# EAGLE design slow clock (EAGLE 8.5.2)

## Sheet 1 of 2
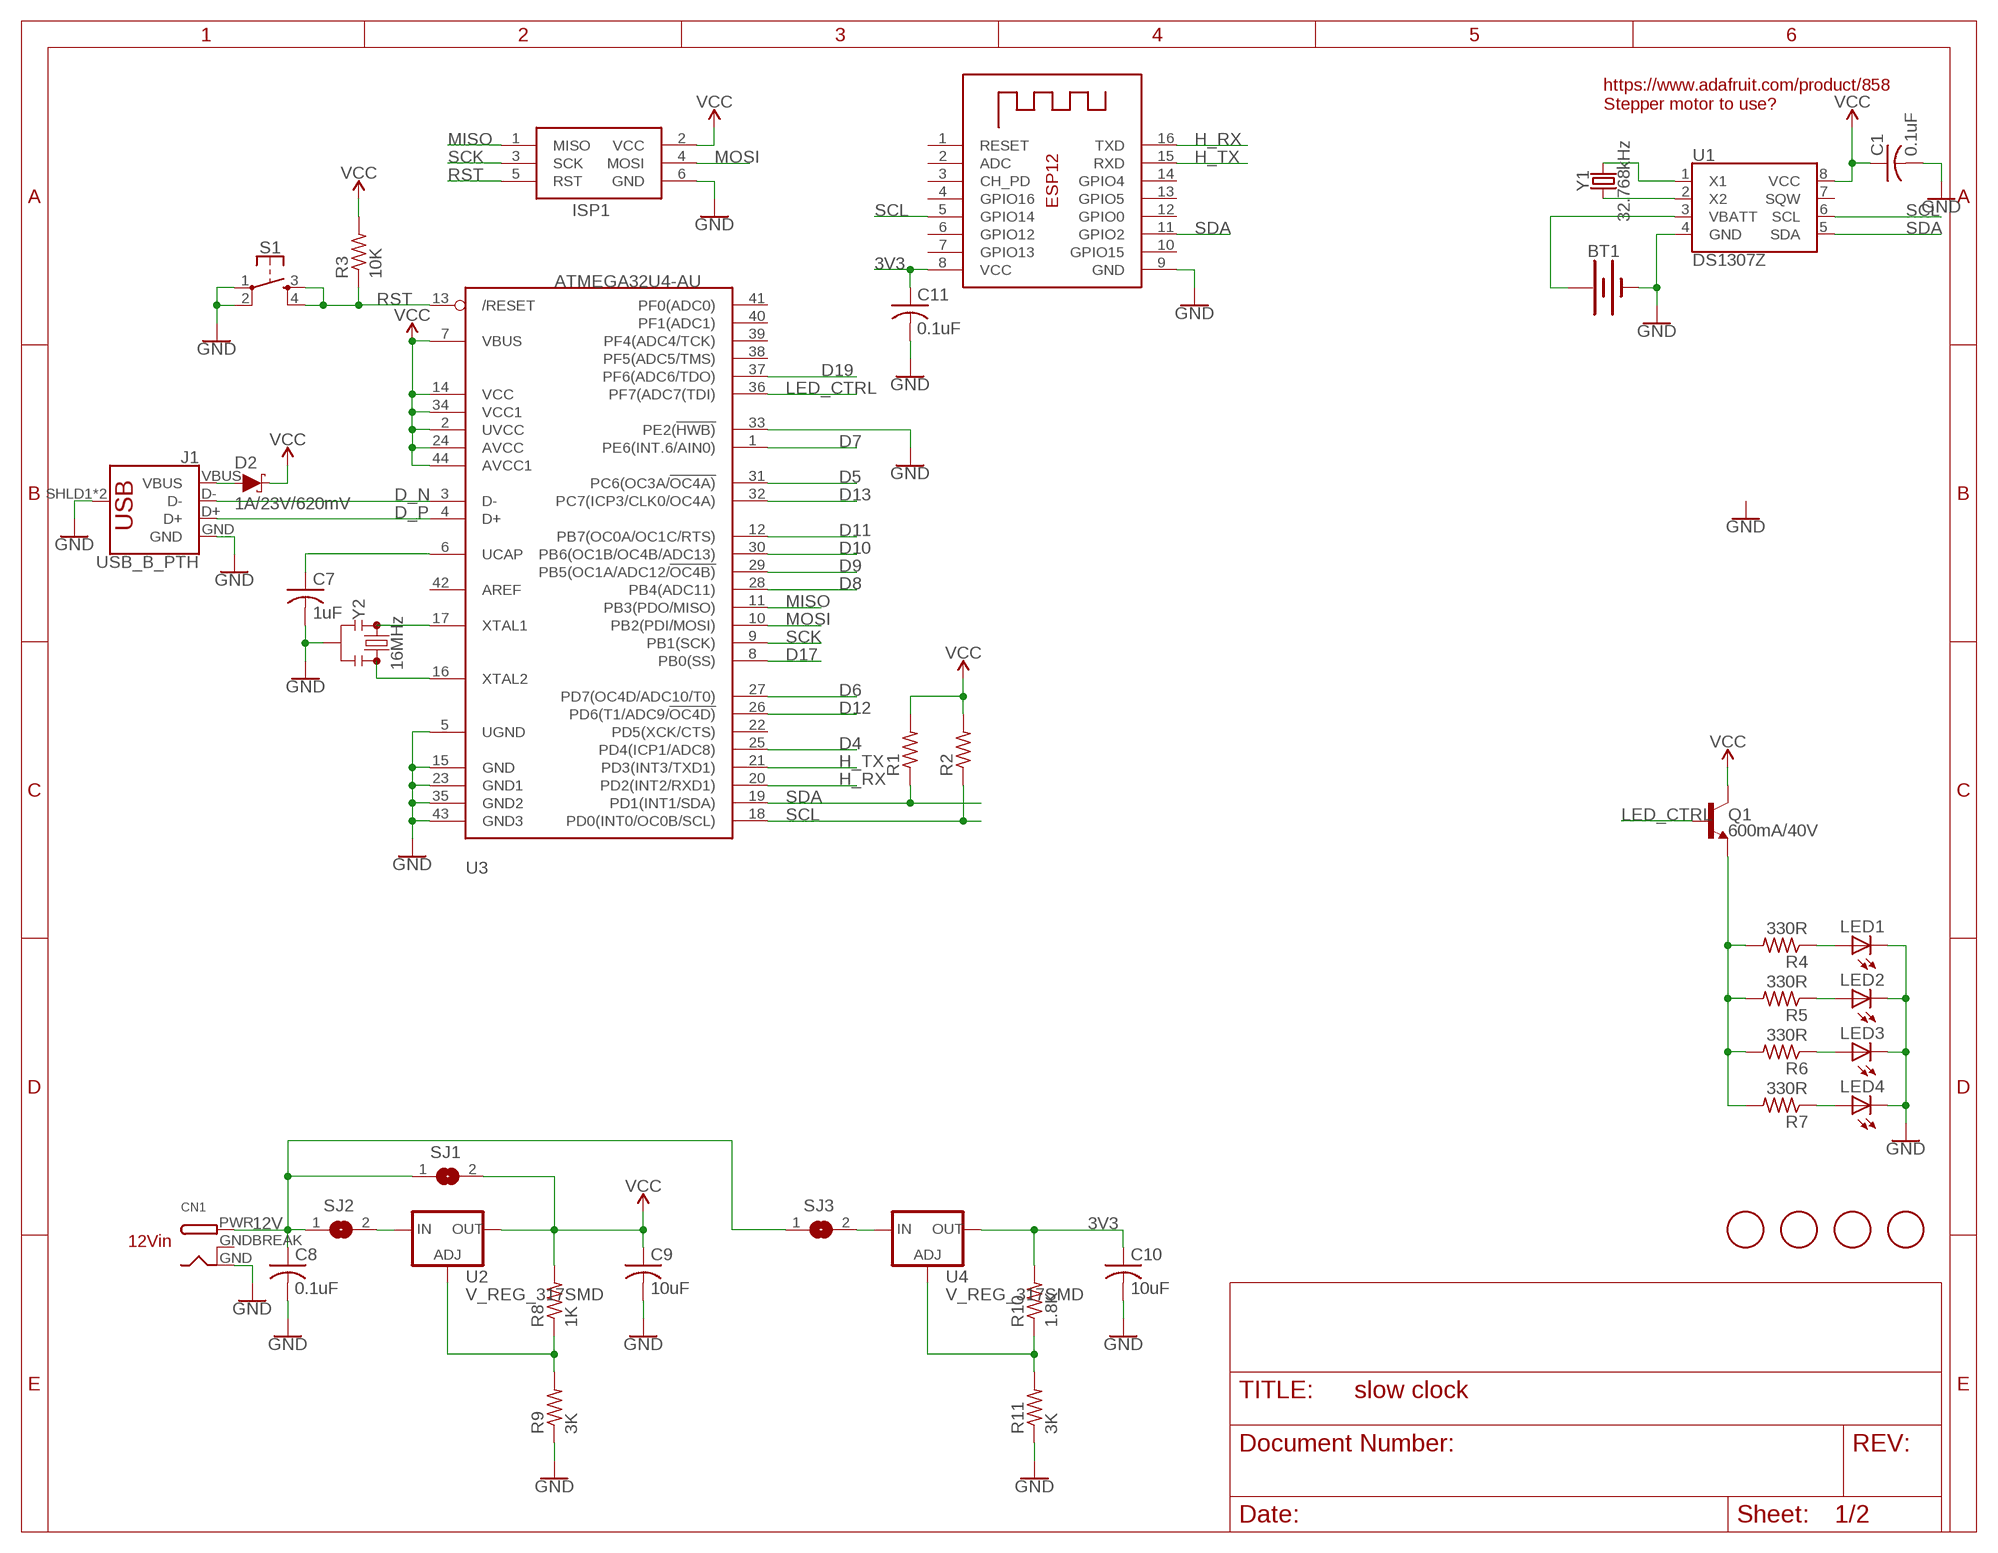
[diagram p0: schematic, sheet 1]

### Parts
BT1  BATTERY-12MM_SMD  [BATTCON_12MM]
C1  0.1uF  C-USC0805  [C0805]
C7  1uF  C-USC0805  [C0805]
C8  0.1uF  C-USC0805  [C0805]
C9  10uF  C-USC0805  [C0805]
C10  10uF  C-USC0805  [C0805]
C11  0.1uF  C-USC0805  [C0805]
CN1  DCBARRELPTH  [DCJACK_2MM_PTH]
D2  1A/23V/620mV  DIODE-SCHOTTKY-BAT20J  [SOD-323]
ISP1  AVRISP-6  [AVRISP]
J1  USB_B_PTH  [USB-B-PTH]
LED1  LEDCHIPLED_0805  [CHIPLED_0805]
LED2  LEDCHIPLED_0805  [CHIPLED_0805]
LED3  LEDCHIPLED_0805  [CHIPLED_0805]
LED4  LEDCHIPLED_0805  [CHIPLED_0805]
Q1  600mA/40V  TRANS_NPN-MMBT2222AL  [SOT23-3]
R1  R-US_R0805  [R0805]
R2  R-US_R0805  [R0805]
R3  10K  R-US_R0805  [R0805]
R4  330R  R-US_R0805  [R0805]
R5  330R  R-US_R0805  [R0805]
R6  330R  R-US_R0805  [R0805]
R7  330R  R-US_R0805  [R0805]
R8  1K  R-US_R0805  [R0805]
R9  3K  R-US_R0805  [R0805]
R10  1.8K  R-US_R0805  [R0805]
R11  3K  R-US_R0805  [R0805]
S1  MOMENTARY-SWITCH-SPST-2-SMD-5.2MM  [TACTILE_SWITCH_SMD_5.2MM]
SJ1  SJ  [SJ]
SJ2  SJ  [SJ]
SJ3  SJ  [SJ]
U1  DS1307Z  [SO08-0.15]
U2  V_REG_317SMD  [SOT223]
U3  ATMEGA32U4-AU  [TQFP44]
U4  V_REG_317SMD  [SOT223]
U$2  FIDUCIAL  [FIDUCIAL_1MM]
U$3  FIDUCIAL  [FIDUCIAL_1MM]
U$4  FIDUCIAL  [FIDUCIAL_1MM]
U$5  FIDUCIAL  [FIDUCIAL_1MM]
X1  ESP-12  [ESP-12]
Y1  32.768kHz  CRYSTAL-32.768KHZPTH-2X6-KIT  [CRYSTAL-PTH-2X6-CYL-KIT]
Y2  16MHz  RESONATOR-16MHZSMD_3.2X1.3  [RESONATOR-SMD-3.2X1.3]

### Nets
3V3: C10.1 C11.1 R10.2 U4.2(OUT) X1.8(VCC)
12V: C8.1 CN1.PWR SJ1.1 SJ2.1 SJ3.1 ; also sheet 2
D4: U3.25(PD4(ICP1/ADC8))
D5: U3.31(PC6(OC3A/!OC4A))
D6: U3.27(PD7(OC4D/ADC10/T0))
D7: U3.1(PE6(INT.6/AIN0))
D8: U3.28(PB4(ADC11))
D9: U3.29(PB5(OC1A/ADC12/!OC4B))
D10: U3.30(PB6(OC1B/OC4B/ADC13)) ; also sheet 2
D11: U3.12(PB7(OC0A/OC1C/RTS)) ; also sheet 2
D12: U3.26(PD6(T1/ADC9/!OC4D)) ; also sheet 2
D13: U3.32(PC7(ICP3/CLK0/OC4A)) ; also sheet 2
D17: U3.8(PB0(SS))
D19: U3.37(PF6(ADC6/TDO))
D_N: J1.D- U3.3(D-)
D_P: J1.D+ U3.4(D+)
GND: BT1.GND(-) C1.2 C7.2 C8.2 C9.2 C10.2 C11.2 CN1.GND ISP1.6(GND) J1.GND J1.SHLD1(SHIELD) J1.SHLD2(SHIELD) LED1.C LED2.C LED3.C LED4.C R9.1 R11.1 S1.1 S1.2 U1.4(GND) U3.5(UGND) U3.15(GND) U3.23(GND1) U3.33(PE2(!HWB)) U3.35(GND2) U3.43(GND3) X1.9(GND) Y2.2 ; also sheet 2
H_RX: U3.20(PD2(INT2/RXD1)) X1.16(TXD)
H_TX: U3.21(PD3(INT3/TXD1)) X1.15(RXD)
LED_CTRL: Q1.1(B) U3.36(PF7(ADC7(TDI))
MISO: ISP1.1(MISO) U3.11(PB3(PDO/MISO))
MOSI: ISP1.4(MOSI) U3.10(PB2(PDI/MOSI))
N$1: U1.2(X2) Y1.1
N$2: U1.1(X1) Y1.2
N$3: BT1.PWR@1(+) U1.3(VBATT)
N$4: U3.16(XTAL2) Y2.3
N$5: Q1.2(E) R4.2 R5.2 R6.2 R7.2
N$6: U3.17(XTAL1) Y2.1
N$7: D2.A J1.VBUS
N$8: C7.1 U3.6(UCAP)
N$9: LED1.A R4.1
N$10: LED2.A R5.1
N$11: LED3.A R6.1
N$12: LED4.A R7.1
N$13: SJ2.2 U2.3(IN)
N$26: R10.1 R11.2 U4.1(ADJ)
N$27: R8.1 R9.2 U2.1(ADJ)
N$28: SJ3.2 U4.3(IN)
RST: ISP1.5(RST) R3.1 S1.3 S1.4 U3.13(/RESET)
SCK: ISP1.3(SCK) U3.9(PB1(SCK))
SCL: R2.1 U1.6(SCL) U3.18(PD0(INT0/OC0B/SCL)) X1.5(GPIO14)
SDA: R1.1 U1.5(SDA) U3.19(PD1(INT1/SDA)) X1.11(GPIO2)
VCC: C1.1 C9.1 D2.C ISP1.2(VCC) Q1.3(C) R1.2 R2.2 R3.2 R8.2 SJ1.2 U1.8(VCC) U2.2(OUT) U3.2(UVCC) U3.7(VBUS) U3.14(VCC) U3.24(AVCC) U3.34(VCC1) U3.44(AVCC1) ; also sheet 2
Unconnected: U1.7(SQW) U3.22(PD5(XCK/CTS)) U3.38(PF5(ADC5/TMS)) U3.39(PF4(ADC4/TCK)) U3.40(PF1(ADC1)) U3.41(PF0(ADC0)) U3.42(AREF) X1.1(RESET) X1.2(ADC) X1.3(CH_PD) X1.4(GPIO16) X1.6(GPIO12) X1.7(GPIO13) X1.10(GPIO15) X1.12(GPIO0) X1.13(GPIO5) X1.14(GPIO4)

### Notes on the sheet
- https://www.adafruit.com/product/858 
  Stepper motor to use?
- 12Vin

## Sheet 2 of 2
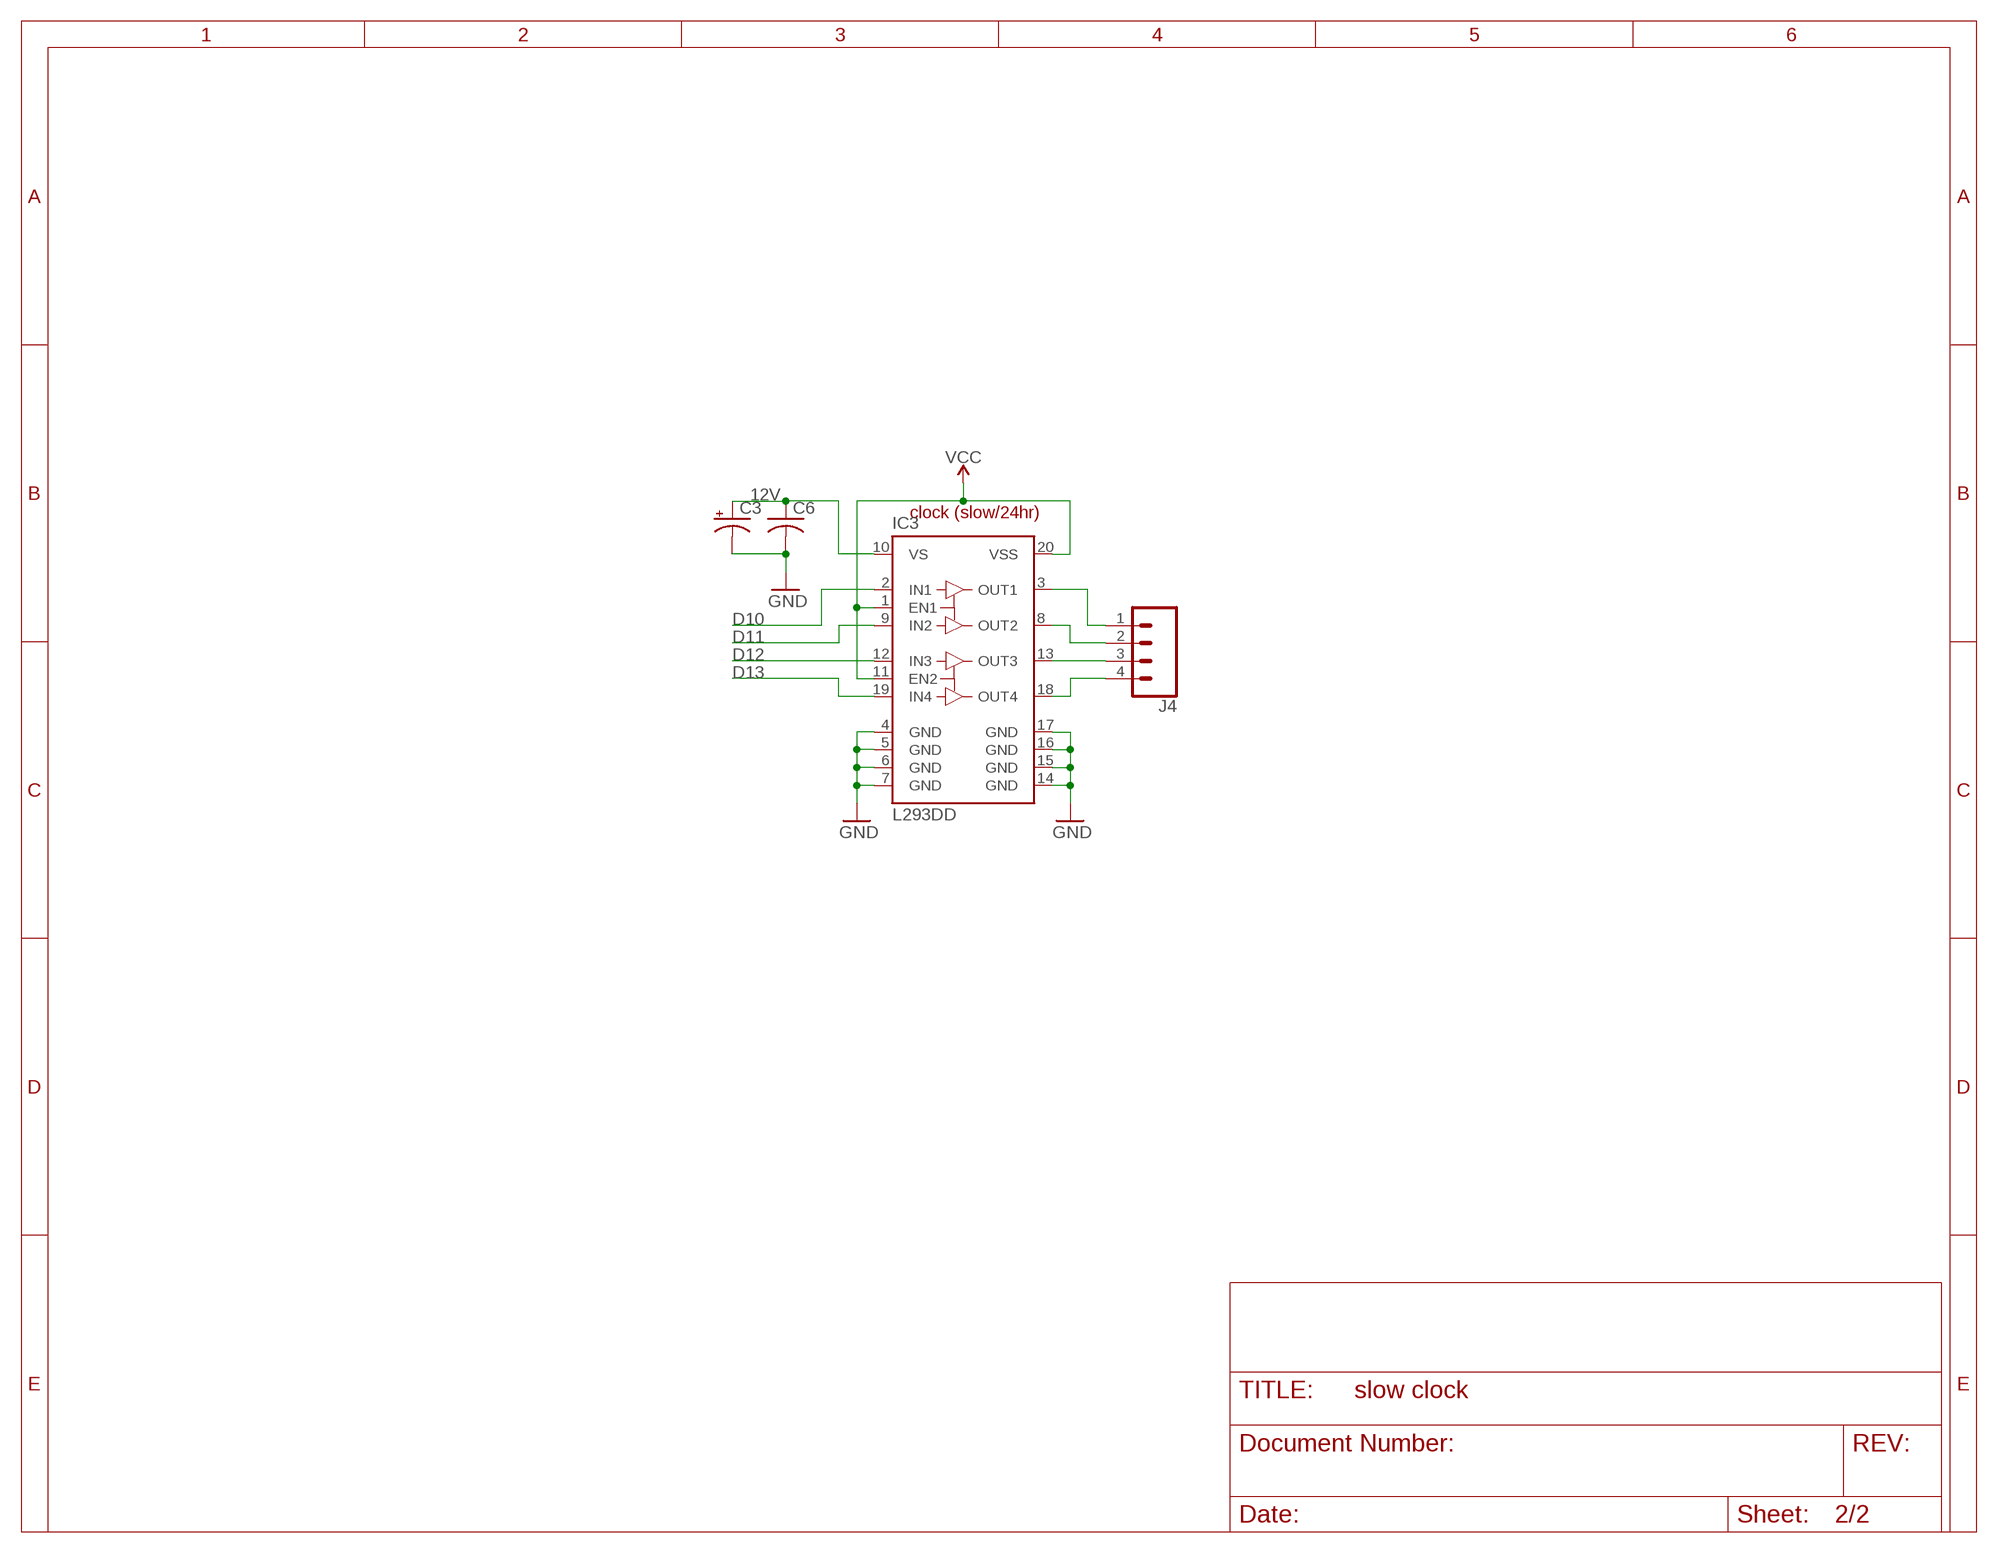
[diagram p1: schematic, sheet 2]

### Parts
C3  CPOL-USD  [PANASONIC_D]
C6  C-USC0805  [C0805]
IC3  L293DD  [SO20]
J4  CONN_04LOCK  [1X04_LOCK]

### Nets
12V: C3.+ C6.1 IC3.10(VS) ; also sheet 1
D10: IC3.2(IN1) ; also sheet 1
D11: IC3.9(IN2) ; also sheet 1
D12: IC3.12(IN3) ; also sheet 1
D13: IC3.19(IN4) ; also sheet 1
GND: C3.- C6.2 IC3.4(GND) IC3.5(GND) IC3.6(GND) IC3.7(GND) IC3.14(GND) IC3.15(GND) IC3.16(GND) IC3.17(GND) ; also sheet 1
N$14: IC3.3(OUT1) J4.1
N$15: IC3.8(OUT2) J4.2
N$16: IC3.13(OUT3) J4.3
N$17: IC3.18(OUT4) J4.4
VCC: IC3.1(EN1) IC3.11(EN2) IC3.20(VSS) ; also sheet 1

### Notes on the sheet
- clock (slow/24hr)

## Power pins joined to a net without a drawn wire
GNDBREAK: CN1.GNDBREAK

## Library data of the parts
BT1 = SparkFun-Batteries:BATTERY: Battery - Single Cell A variety of battery chemistries, sizes, and footprints. Device List: 20MM_PTH - Coin Cell Battery Holder - 20mm (PTH) <https://www.sparkfun.com/products/783> 6.8MM_PTH - Coin Cell Battery Holder - 6.8MM(SMD) <https://www.digikey.com/product-detail/en/seiko-instruments/MS621FE-FL11E/728-1057-ND/1889208?WT.srch=1&gclid=CNOQ5a6LzdQCFZS2wAodXCkE0g> 12MM_SMD - Coin Cell Battery Holder - 12mm (SMD) <https://www.sparkfun.com/products/10592> 12MM_PTH - Coin Cell Battery Holder - 12mm (PTH) <https://www.sparkfun.com/products/7948> 20MM_SMD - 20mm Coin Cell Battery Holder (SMD) (2 legs) Used on the Big Time Watch Kit <https://www.sparkfun.com/products/11734> 20MM_SMD_4LEGS - Coin Cell Battery Holder - 20mm (SMD) <https://www.sparkfun.com/products/11892> 20MM_SMD_4LEGS_OVERPASTE - Coin Cell Battery Holder - 20mm (SMD) <https://www.sparkfun.com/products/11892> (Over-paste on the legs) 24.5MM_PTH - Coin Cell Battery Holder - 24.5mm (PTH) <https://www.sparkfun.com/products/8863> 9V - 9V Battery Holder - PC Mount Used on the SparkFun SparkPunk Sound Kit <https://www.sparkfun.com/products/11177> and SparkFun SparkPunk Sequencer Kit <https://www.sparkfun.com/products/12707> 18650 - Battery Holder - 18650 (PTH) <https://www.sparkfun.com/products/13113> AA - Battery Holder - 1xAA (PTH) <https://www.sparkfun.com/products/7949> AAA - Battery Holder - 1xAAA (PTH) <https://www.sparkfun.com/products/12718> AA_KIT - Battery Holder - 1xAA (PTH) <https://www.sparkfun.com/products/7949> Special kit package - pads only have exposed copper on one side of the board. AAA_KIT - Battery Holder - 1xAAA (PTH) <https://www.sparkfun.com/products/12718> Special kit package - pads only have exposed copper on one side of the board.; PROD_ID: BATT-08044; SF_SKU: PRT-10592
C1 C6-C11 = resistor:C-US: CAPACITOR, American symbol
C3 = resistor:CPOL-US: POLARIZED CAPACITOR, American symbol
CN1 = adafruit:DCBARREL: 2.0mm DC Barrel Jack DCJACK_2MM_PTH - Through Hole Jack (4UConnector: 05537)
D2 = SparkFun-DiscreteSemi:DIODE-SCHOTTKY: Schottky diode A Schottky diode is a semiconductor diode which has a low forward voltage drop and a very fast switching action.; PROD_ID: DIO-11623
IC3 = st-microelectronics:L293DD: PUSH-PULL FOUR CHANNEL DRIVER WITH DIODES Source: http://www.st.com/stonline/books/pdf/docs/1330.pdf; OC_FARNELL: unknown
ISP1 = adafruit:AVRISP: AVR ISP HEADER Standard 6 pin header for AVR programming
J1 = SparkFun-Connectors:USB_B: USB Type B Connector SparkFun Products: SparkFun Stepoko <https://www.sparkfun.com/products/13899> PTH; PROD_ID: CONN-08278; SF_ID: PRT-00139
J4 = SparkFun-Connectors:CONN_04: Multi connection point. Often used as Generic Header-pin footprint for 0.1 inch spaced/style header connections On any of the 0.1 inch spaced packages, you can populate with these: Break Away Headers - Straight <https://www.sparkfun.com/products/116> (PRT-00116) Break Away Male Headers - Right Angle <https://www.sparkfun.com/products/553> (PRT-00553) Female Headers <https://www.sparkfun.com/products/115> (PRT-00115) Break Away Headers - Machine Pin <https://www.sparkfun.com/products/117> (PRT-00117) Break Away Female Headers - Swiss Machine Pin <https://www.sparkfun.com/products/743> (PRT-00743) For SCREWTERMINALS and SPRING TERMINALS visit here: Screw Terimnals on SparkFun.com <https://www.sparkfun.com/search/results?term=Screw+Terminals> (5mm/3.5mm/2.54mm spacing) This device is also useful as a general connection point to wire up your design to another part of your project. Our various solder wires solder well into these plated through hole pads. Hook-Up Wire - Assortment (Stranded, 22 AWG) <https://www.sparkfun.com/products/11375> (PRT-11375) Hook-Up Wire - Assortment (Solid Core, 22 AWG) <https://www.sparkfun.com/products/11367> (PRT-11367) View the entire wire category on our website here <https://www.sparkfun.com/categories/141> Special notes: Molex polarized connector foot print use with SKU : PRT-08231 with associated crimp pins and housings. 1MM SMD Version SKU: PRT-10208; PROD_ID: CONN-09696
LED1-LED4 = adafruit:LED: LED OSRAM: - CHIPLED LG R971, LG N971, LY N971, LG Q971, LY Q971, LO R971, LY R971 LH N974, LH R974 LS Q976, LO Q976, LY Q976 LO Q996 - Hyper CHIPLED LW Q18S LB Q993, LB Q99A, LB R99A - SideLED LS A670, LO A670, LY A670, LG A670, LP A670 LB A673, LV A673, LT A673, LW A673 LH A674 LY A675 LS A676, LA A676, LO A676, LY A676, LW A676 LS A679, LY A679, LG A679 - Hyper Micro SIDELED® LS Y876, LA Y876, LO Y876, LY Y876 LT Y87S - SmartLED LW L88C, LW L88S LB L89C, LB L89S, LG L890 LS L89K, LO L89K, LY L89K LS L896, LA L896, LO L896, LY L896 - TOPLED LS T670, LO T670, LY T670, LG T670, LP T670 LSG T670, LSP T670, LSY T670, LOP T670, LYG T670 LG T671, LOG T671, LSG T671 LB T673, LV T673, LT T673, LW T673 LH T674 LS T676, LA T676, LO T676, LY T676, LB T676, LH T676, LSB T676, LW T676 LB T67C, LV T67C, LT T67C, LS T67K, LO T67K, LY T67K, LW E67C LS E67B, LA E67B, LO E67B, LY E67B, LB E67C, LV E67C, LT E67C LW T67C LS T679, LY T679, LG T679 LS T770, LO T770, LY T770, LG T770, LP T770 LB T773, LV T773, LT T773, LW T773 LH T774 LS E675, LA E675, LY E675, LS T675 LS T776, LA T776, LO T776, LY T776, LB T776 LHGB T686 LT T68C, LB T68C - Hyper Mini TOPLED® LB M676 - Mini TOPLED Santana® LG M470 LS M47K, LO M47K, LY M47K Source: http://www.osram.convergy.de/
Q1 = SparkFun-DiscreteSemi:TRANS_NPN: NPN transistor Current controlled devices typically used to amplify current or used as a switch. BC547 - COM-08928 <http://www.sparkfun.com/products/8928> (TO-92 45V 100mA) (1.Collector 2.Base 3.Emitter) 2N3904 - COM-00521 <http://www.sparkfun.com/products/521> (TO-92 40V 200mA) (1.Emitter 2.Base 3.Collector) P2N2222A - COM-12852 <http://www.sparkfun.com/products/12852> (TO-92 40V 600mA) (1.Collector 2.Base 3.Emitter); PROD_ID: TRANS-08049
R1-R11 = resistor:R-US_: RESISTOR, American symbol
S1 = SparkFun-Switches:MOMENTARY-SWITCH-SPST-2: Momentary Switch (Pushbutton) - SPST - Two Circuits Normally-open (NO) SPST momentary switches (buttons, pushbuttons). Schematic symbol includes two switch circuits. Variants SMD-4.6MMX2.8MM - 4.60mm x 2.80mm Tactile Momentary Button Switch - Used on SparkFun SAMD21 Mini Breakout <https://www.sparkfun.com/products/13664> SMD-5.2MM - Mini Pushbutton Switch - SMD <https://www.sparkfun.com/products/8720> - Used on Arduino Pro Mini <https://www.sparkfun.com/products/11114>; PROD_ID: SWCH-08247; SF_SKU: COM-08720
SJ1-SJ3 = jumper:SJ: SMD solder JUMPER
U1 = SparkFun-Clocks:DS1307: Maxim DS1307 - I2C Real-time clock (RTC) The DS1307 serial real-time clock (RTC) is a low-power, full binary-coded decimal (BCD) clock/calendar plus 56 bytes of NV SRAM. Address and data are transferred serially through an I2C, bidirectional bus. The clock/calendar provides seconds, minutes, hours, day, date, month, and year information. SparkFun Products: Real Time Clock Module <https://www.sparkfun.com/products/12708> (BOB-12708) Datasheet <https://cdn.sparkfun.com/datasheets/BreakoutBoards/DS1307.pdf>; PROD_ID: IC-08138
U2 U4 = SparkFun-IC-Power:V_REG_317: Voltage Regulator Standard LM317 adjustable voltage regulator. AOI (Adjust Output Input). Google 'LM317 Calculator' for easy to use app to get the two resistor values needed. 240/720 for 5V output. 240/390 for 3.3V output. Spark Fun Electronics SKU : COM-00527
U3 = adafruit:ATMEGA32U4: http://www.ladyada.net/library/eagle
U$2-U$5 = adafruit:FIDUCIAL: For use by pick and place machines to calibrate the vision/machine, 1mm By microbuilder.eu
X1 = adafruit:ESP-12
Y1 = SparkFun-Clocks:CRYSTAL-32.768KHZ: 32.768kHz Crystal Frequency: 32.768kHz Frequency Stability: ±20ppm Load Capacitance: 12.5pF (PTH-2X6 & SMD-3.2X1.5), 6pF (SMD-2X6) SparkFun Products: SparkFun BigTime Watch Kit <https://www.sparkfun.com/products/11734> SparkFun nRF52832 Breakout <https://www.sparkfun.com/products/13990> SparkFun Real Time Clock Module <https://www.sparkfun.com/products/12708>; PROD_ID: XTAL-10112
Y2 = SparkFun-Clocks:RESONATOR-16MHZ: 16MHz Resonator Digikey Example <http://www.digikey.com/product-detail/en/murata-electronics-north-america/CSTCE16M0V53-R0/490-1198-1-ND/584635> Frequency: 16MHz Frequency Stability: ±0.3% Frequency Tolerance: ±0.5% Capacitance: 15pF SparkFun Products SparkFun OpenLog <https://www.sparkfun.com/products/13712> SparkFun MicroView - OLED Arduino Module <https://www.sparkfun.com/products/12923>; PROD_ID: XTAL-08900

## Board
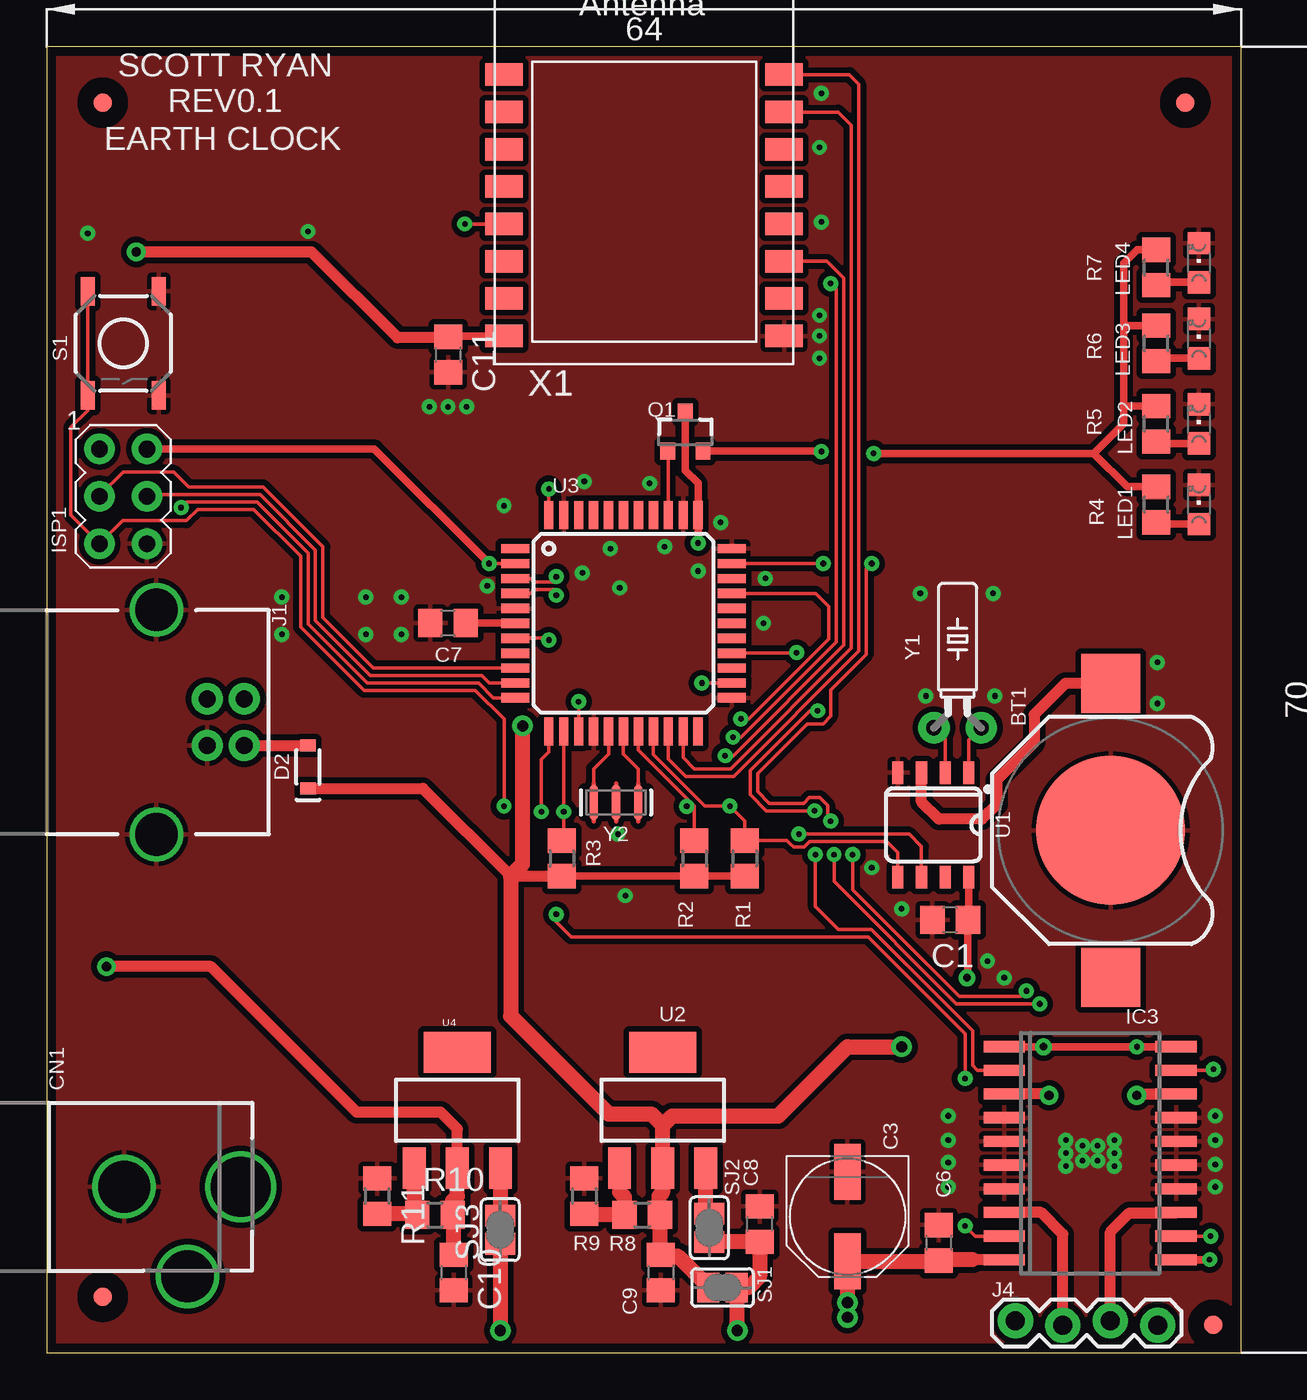
[diagram p2: board, top side]
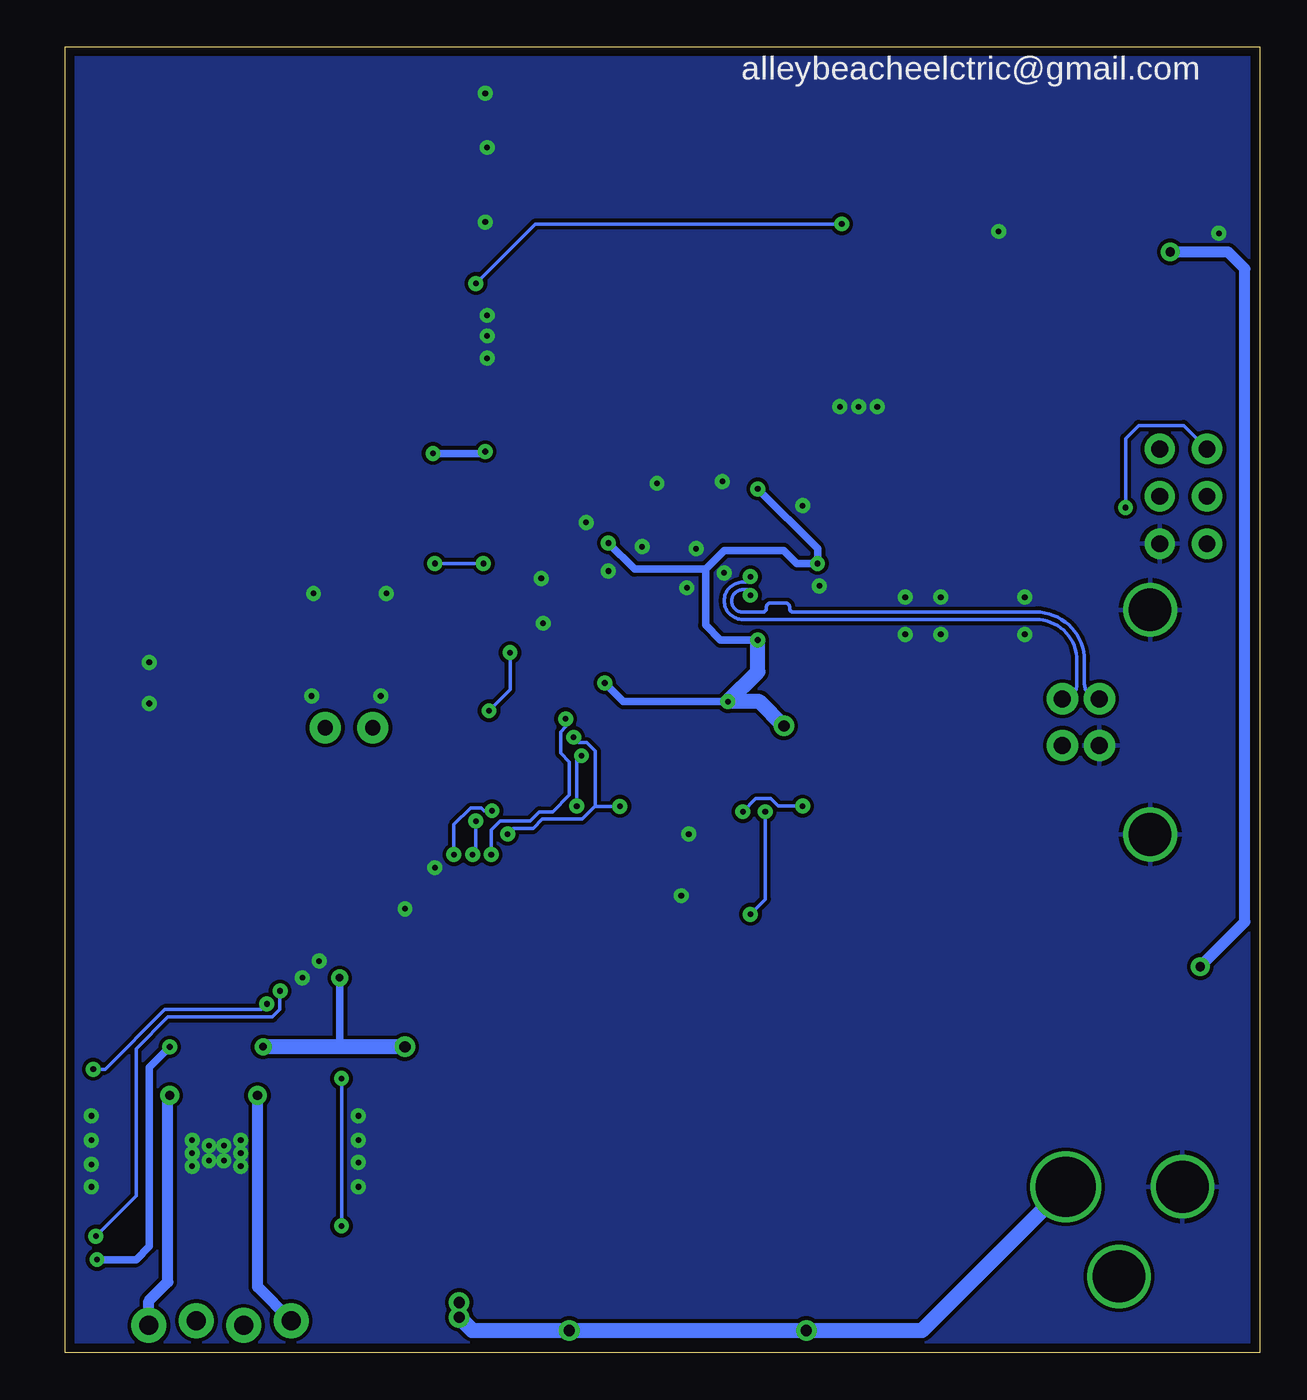
[diagram p3: board, bottom side, seen from below]

Size 64 x 70 mm. Coordinates in mm from the lower left corner, seen from the top.
Outline: 0,0 64,0 64,70 0,70 0,0
Copper layers (1*16): Top 0.035mm / dielectric 1.5mm / Bottom 0.035mm
Design rules "Class_5_0,20mm *": minimum track width 0.2mm, minimum drill 0.3mm, track to track 0.2mm, track to pad 0.2mm, pad to pad 0.2mm, via to via 0.2mm, smd to smd 0.2mm, copper to edge 0.5mm, drill to drill 0.2mm, minimum pad ring 0.3mm, minimum via ring 0.25mm, stop-mask expansion 0.1mm, vias tented up to drill 0.6mm, thermal gap 0.25mm

### Footprints (pad centres in the part's own frame; a part is rotated, then mirrored left to right if it is on the bottom)
BATTCON_12MM = smd 8 x 8: GND 0,0 | smd 3.175 x 3.175: PWR@1 -7.874,0; PWR@2 7.874,0
C0805 = smd 1.3 x 1.5: 1 -0.95,0; 2 0.95,0
PANASONIC_D = smd 3 x 1.4: + 2.4,0; - -2.4,0
DCJACK_2MM_PTH = drill 2.8: GND 0,7.35; GNDBREAK 4.8,10.75 | drill 3.2: PWR 0,13.6
SOD-323 = smd 0.63 x 0.83: A 1.15,0; C -1.15,0
SO20 = smd 0.6 x 2.2: 1 -5.715,-4.6; 2 -4.445,-4.6; 3 -3.175,-4.6; 4 -1.905,-4.6; 5 -0.635,-4.6; 6 0.635,-4.6; 7 1.905,-4.6; 8 3.175,-4.6; 9 4.445,-4.6; 10 5.715,-4.6; 11 5.715,4.6; 12 4.445,4.6; 13 3.175,4.6; 14 1.905,4.6; 15 0.635,4.6; 16 -0.635,4.6; 17 -1.905,4.6; 18 -3.175,4.6; 19 -4.445,4.6; 20 -5.715,4.6
AVRISP = drill 0.9 pad 1.626: 1 -1.27,2.54; 2 1.27,2.54; 3 -1.27,0; 4 1.27,0; 5 -1.27,-2.54; 6 1.27,-2.54
USB-B-PTH = drill 0.914 pad 1.676: D+ 4,1.25; D- 5.981,1.25; GND 4,-1.25; VBUS 5.981,-1.25 | drill 2.286: SHLD1 1.282,-6.02; SHLD2 1.282,6.02
1X04_LOCK = drill 1.016 pad 1.88: 1 0,0.127; 2 2.54,-0.127; 3 5.08,0.127; 4 7.62,-0.127
CHIPLED_0805 = smd 1.2 x 1.2: A 0,-1.05; C 0,1.05
SOT23-3 = smd 0.8 x 0.9: 1 -0.95,-1; 2 0.95,-1; 3 0,1.1
R0805 = smd 1.3 x 1.5: 1 -0.95,0; 2 0.95,0
TACTILE_SWITCH_SMD_5.2MM = smd 1.524 x 0.762: 1 -2.794,1.905; 2 2.794,1.905; 3 -2.794,-1.905; 4 2.794,-1.905
SJ = smd 1.168 x 1.6: 1 -0.762,0; 2 0.762,0
SO08-0.15 = smd 0.6 x 1.2: 1 -1.905,-2.8; 2 -0.635,-2.8; 3 0.635,-2.8; 4 1.905,-2.8; 5 1.905,2.8; 6 0.635,2.8; 7 -0.635,2.8; 8 -1.905,2.8
SOT223 = smd 1.219 x 2.235: 1 -2.311,-3.099; 2 0,-3.099; 3 2.311,-3.099 | smd 3.6 x 2.2: 4 0,3.099
TQFP44 = smd 1.5 x 0.5: 1 -5.8,4; 2 -5.8,3.2; 3 -5.8,2.4; 4 -5.8,1.6; 5 -5.8,0.8; 6 -5.8,0; 7 -5.8,-0.8; 8 -5.8,-1.6; 9 -5.8,-2.4; 10 -5.8,-3.2; 11 -5.8,-4; 23 5.8,-4; 24 5.8,-3.2; 25 5.8,-2.4; 26 5.8,-1.6; 27 5.8,-0.8; 28 5.8,0; 29 5.8,0.8; 30 5.8,1.6; 31 5.8,2.4; 32 5.8,3.2; 33 5.8,4 | smd 0.5 x 1.5: 12 -4,-5.8; 13 -3.2,-5.8; 14 -2.4,-5.8; 15 -1.6,-5.8; 16 -0.8,-5.8; 17 0,-5.8; 18 0.8,-5.8; 19 1.6,-5.8; 20 2.4,-5.8; 21 3.2,-5.8; 22 4,-5.8; 34 4,5.8; 35 3.2,5.8; 36 2.4,5.8; 37 1.6,5.8; 38 0.8,5.8; 39 0,5.8; 40 -0.8,5.8; 41 -1.6,5.8; 42 -2.4,5.8; 43 -3.2,5.8; 44 -4,5.8
FIDUCIAL_1MM = smd 1 x 1: 1 0,0
ESP-12 = smd 2 x 1.2: 1 -7.5,4.5; 2 -7.5,2.5; 3 -7.5,0.5; 4 -7.5,-1.5; 5 -7.5,-3.5; 6 -7.5,-5.5; 7 -7.5,-7.5; 8 -7.5,-9.5; 9 7.5,-9.5; 10 7.5,-7.5; 11 7.5,-5.5; 12 7.5,-3.5; 13 7.5,-1.5; 14 7.5,0.5; 15 7.5,2.5; 16 7.5,4.5
CRYSTAL-PTH-2X6-CYL-KIT = drill 0.813 pad 1.676: 1 -1.27,0; 2 1.27,0
RESONATOR-SMD-3.2X1.3 = smd 0.45 x 1.905: 1 -1.2,0; 2 0,0; 3 1.2,0

### Placement (x,y rotation side)
BT1  57,28 270 top
C1  48.4,23.2 180 top
C3  42.9,7.3 270 top
C6  47.8,5.9 90 top
C7  21.5,39.1 180 top
C8  38.2,6.9 90 top
C9  32.9,4.3 270 top
C10  21.8,4.3 270 top
C11  21.5,53.5 270 top
CN1  -3.2,8.9 270 top
D2  14,31.4 90 top
IC3  55.9,10.7 270 top
ISP1  4.1,45.9 0 top
J1  4.6,33.8 0 top
J4  51.9,1.6 0 top
LED1  61.72,45.46 0 top
LED2  61.72,49.78 0 top
LED3  61.72,54.35 0 top
LED4  61.72,58.42 0 top
Q1  34.21,49.32 0 top
R1  37.4,26.5 270 top
R2  34.7,26.5 270 top
R3  27.6,26.5 270 top
R4  59.44,45.46 90 top
R5  59.44,49.78 90 top
R6  59.44,54.1 90 top
R7  59.44,58.16 90 top
R8  31.9,7.4 0 top
R9  28.8,8.4 270 top
R10  20.8,7.4 0 top
R11  17.7,8.4 270 top
S1  4.1,54.1 270 top
SJ1  36.2,3.5 180 top
SJ2  35.5,6.7 90 top
SJ3  24.3,6.6 90 top
U1  47.5,28.3 180 top
U2  33,13 0 top
U3  30.9,39.1 0 top
U4  22,13 0 top
U$2  61,67 0 top
U$3  3,67 0 top
U$4  62.5,1.5 0 top
U$5  3,3 0 top
X1  32,64 0 top
Y1  48.8,33.5 0 top
Y2  30.5,29.5 180 top

### Tracks (layer width: path | path; a pad name or v marks a point on that pad's centre or on a via)
3V3  (via drill 0.5)
  Top 0.4: X1.8 21.55,54.5 C11.1
  Top 0.6: U4.2 22,12 21.1,12.9 16.6,12.9 8.8,20.7 v3.2,20.7 | C11.1 21.45,54.4 18.8,54.4 14.2,59 v4.8,59
  Top 0.8: C10.1 21.8,7.35 R10.2 21.75,8.15 22,8.4 U4.2
  Bottom 0.6: v3.2,20.7 0.8,23.1 0.8,58.1 1.7,59 v4.8,59
12V  (via drill 0.6)
  Top 0.6: IC3.10 49.62,4.99 49.6,5
  Top 0.8: 49.6,5 47.85,5 C6.1 47.75,4.9 C3.+ v42.9,2.7 v42.9,1.9 | SJ3.1 v24.3,1.2 | SJ2.1 38.19,5.94 C8.1 38.2,4.1 37.6,3.5 SJ1.1 36.96,1.24 v37,1.2
  Bottom 0.8: v42.9,2.7 v42.9,1.9 42.2,1.2 v37,1.2 v24.3,1.2 18.1,1.2 12,7.3 CN1.PWR
D10  (via drill 0.3)
  Top 0.2: IC3.2 49.85,15.14 49.6,15.4 49.6,17.27 44.17,22.7 42.4,22.7 41.18,23.92 v41.18,26.7 | v37.19,33.98 37.62,33.98 41.9,38.26 41.9,40 41.2,40.7 U3.30
  Bottom 0.2: v41.18,26.7 41.18,28.02 40.7,28.5 39.1,28.5 38.6,29 37.89,29 37,29.89 37,31.67 37.47,32.13 37.47,33.28 37.19,33.56 | 37.19,33.56 | v37.19,33.98 37.19,33.6 37.19,33.56
D11  (via drill 0.3)
  Top 0.2: IC3.9 49.74,6.25 v49.2,6.8 | v27.3,23.5 27.3,23.1 28.1,22.3 44,22.3 49.2,17.1 v49.2,14.7 | v26.5,29 26.5,31.8 26.9,32.2 U3.12
  Bottom 0.2: v27.3,23.5 26.5,24.3 v26.5,29 | v49.2,6.8 v49.2,14.7
D12  (via drill 0.3)
  Top 0.2: IC3.12 v62.35,6.25 | v52.49,19.4 52.19,19.1 48.9,19.1 43.18,24.82 v43.18,26.7 | v40.17,37.53 40.15,37.5 U3.26 | v41.14,29.05 38.55,29.05 37.68,29.92 37.68,31.22 40.88,34.41 v41.3,34.41
  Bottom 0.2: v62.35,6.25 60.2,8.41 60.2,16.3 58.5,18 52.91,18 52.5,18.41 52.5,19.39 v52.49,19.4 | v41.14,29.05 41.56,29.05 41.71,29.2 42.29,29.2 43.18,28.31 v43.18,26.7 | v41.3,34.41 40.17,35.54 v40.17,37.53
D13  (via drill 0.3)
  Top 0.2: v62.5,15.2 62.45,15.14 IC3.19 | U3.32 v41.6,42.3 | v44.2,42.3 43.9,42 43.9,37.43 42,35.53 42,34.12 41.59,33.71 40.74,33.71 38.08,31.05 38.08,30.08 38.71,29.45 40.55,29.45 40.85,29.75 41.43,29.75 41.84,29.34 41.84,28.66 v42,28.5 | v42.18,26.7 42.18,25.25 48.73,18.7 v53.2,18.7
  Bottom 0.2: v62.5,15.2 61.87,15.2 58.67,18.4 53.5,18.4 v53.2,18.7 | v41.6,42.3 v44.2,42.3 | v42,28.5 42,26.88 v42.18,26.7
D_N  (via drill 0.3)
  Top 0.2: v27.3,41.6 27.3,41.3 26.1,41.3 25.9,41.5 U3.3
  Bottom 0.2: J1.D- arc-90 9.8,35.83 9.8,37.1 arc-90 12,39.3 27.7,39.3 arc90 28.7,40.3 arc90 27.7,41.3 27.3,41.3 v27.3,41.6
D_P  (via drill 0.3)
  Top 0.2: v27.3,40.6 27.3,40.9 26.1,40.9 25.9,40.7 U3.4
  Bottom 0.2: J1.D+ arc90 9.4,35.85 9.4,37.1 arc-90 12,39.7 25,39.7 arc90 25.2,39.9 25.2,39.98 arc-90 25.4,40.18 26.24,40.18 arc-90 26.44,39.98 26.44,39.9 arc90 26.64,39.7 27.7,39.7 arc90 28.3,40.3 arc90 27.7,40.9 27.3,40.9 v27.3,40.6
GND  (via drill 0.3)
  other vias: 28.7,41.8 56.3,11.1 55.5,11.1 55.5,10.3 56.3,10.3 57.2,10 57.2,10.7 57.2,11.4 54.6,10.7 54.6,11.4 54.6,10 23.6,41.1 30.6,27.8 31,24.5 48.3,12.7 48.3,11.4 48.3,10.2 48.3,8.9 62.6,8.9 62.6,10.1 62.6,11.4 62.6,12.7 45.8,23.8 44.2,26 51.3,20.1 50.4,21 59.5,34.8 59.5,37 50.8,35.2 50.7,40.7 46.8,40.7 47.1,35.2 34.9,41.9 36.1,44.5 38.5,41.5 38.4,39.1 33.1,43.2 32.3,46.6 28.8,46.7 30.2,43.1 30.7,41 24.5,45.4 19,38.5 19,40.5 17.1,38.5 17.1,40.5 12.6,40.5 12.6,38.5 2.2,60 14,60.1 41.4,54.5 41.4,55.6 41.4,53.3 21.5,50.7 22.5,50.7 20.5,50.7 41.5,60.6 41.4,64.6 41.5,67.5
  pour Top (isolate 0.305): 0,0 0,69.85 63.5,69.85 63.5,0
  pour Bottom: 63.5,0 64.01,69.85 0,69.85 0,0
H_RX
  Top 0.2: X1.16 43,68.5 43.5,68 43.5,37.6 36.8,30.9 34.23,30.9 33.3,31.83 U3.20
H_TX
  Top 0.2: X1.15 42.4,66.5 43.1,65.8 43.1,37.77 36.63,31.3 34.7,31.3 34.1,31.9 U3.21
LED_CTRL
  Top 0.2: U3.36 33.3,48.28 Q1.1
MISO  (via drill 0.3)
  Top 0.2: U3.11 23.93,35.1 23.13,35.9 17.17,35.9 14,39.07 14,42.87 11.27,45.6 9.3,45.6 7.5,45.6 v7.2,45.3
  Bottom 0.2: v7.2,45.3 7.2,49 6.5,49.7 4.09,49.7 ISP1.1
MOSI
  Top 0.2: U3.10 23.7,35.9 23.3,36.3 17.33,36.3 14.4,39.23 14.4,43.03 11.43,46 5.47,46 ISP1.4
N$1
  Top 0.2: Y1.1 48.13,32.9 U1.2
N$2
  Top 0.2: Y1.2 49.41,32.84 U1.1
N$3
  Top 0.6: BT1.PWR@1 54.57,35.87 52.9,34.2 52.9,32.7 50.9,30.7 50.9,29.4 50.1,28.6 47.8,28.6 46.87,29.54 U1.3
N$4
  Top 0.2: U3.16 30.1,32.1 29.3,31.3 Y2.3
N$5  (via drill 0.3)
  Top 0.4: Q1.2 41.48,48.32 v41.5,48.3 | v44.3,48.2 56.1,48.2 | R4.2 57.89,46.41 56.1,48.2 | 56.1,48.2 57.7,49.8 57.7,50.8 | 57.7,50.8 57.7,55 | 57.7,55 57.7,58.4 58.41,59.11 R7.2 | R6.2 57.75,55.05 57.7,55 | R5.2 57.77,50.73 57.7,50.8
  Bottom 0.4: v41.5,48.3 41.6,48.2 v44.3,48.2
N$6
  Top 0.2: U3.17 30.9,32.1 31.7,31.3 Y2.1
N$7
  Top 0.6: J1.VBUS D2.A
N$8
  Top 0.4: C7.1 U3.6
N$9
  Top 0.4: LED1.A 59.54,44.41 R4.1
N$10
  Top 0.4: LED2.A 59.54,48.73 R5.1
N$11
  Top 0.4: LED3.A 59.59,53.3 R6.1
N$12
  Top 0.4: LED4.A 59.59,57.37 R7.1
N$13
  Top 0.8: SJ2.2 35.31,7.65 U2.3
N$14  (via drill 0.5)
  Top 0.6: v53.7,13.8 53.62,13.88 IC3.3
  Bottom 0.6: J4.1 53.7,3.53 v53.7,13.8
N$15
  Top 0.6: J4.2 54.44,6.36 53.27,7.53 IC3.8
N$16
  Top 0.6: J4.3 56.98,6.48 58,7.5 60.48,7.5 IC3.13
N$17  (via drill 0.5)
  Top 0.6: v58.4,13.8 58.48,13.88 IC3.18
  Bottom 0.6: J4.4 59.52,2.78 58.5,3.8 58.5,13.7 v58.4,13.8
N$26
  Top 0.8: U4.1 19.69,7.56 R10.1 19.8,7.45 R11.2
N$27
  Top 0.8: R9.2 28.85,7.4 R8.1 30.95,8.35 30.69,8.61 U2.1
N$28
  Top 0.8: U4.3 SJ3.2
RST  (via drill 0.3)
  Top 0.2: R3.1 27.7,27.55 v27.7,29 U3.13 | S1.3 S1.4 2.19,50.49 1.3,49.6 1.3,44.89 ISP1.5 4.07,44.6 7.49,44.6 8.09,45.2 11.1,45.2 13.6,42.7 13.6,38.9 17,35.5 22.97,35.5 24.5,33.97 v24.5,29.3
  Bottom 0.2: v24.5,29.3 25.81,29.3 26.21,29.7 27,29.7 v27.7,29
SCK
  Top 0.2: U3.9 17.5,36.7 14.8,39.4 14.8,43.2 11.6,46.4 7.6,46.4 6.8,47.2 4.1,47.2 2.83,45.93 ISP1.3
SCL  (via drill 0.3)
  Top 0.2: U1.6 46.87,27.14 46.2,27.8 v40.3,27.8 | 34.65,27.4 R2.1 34.7,29.3 34.6,29.4 | U3.18 31.7,32.3 34.6,29.4 | X1.5 v22.4,60.5 | v42,57.31 42.3,57.01 42.3,38.1 37.19,32.99 v36.77,32.99 | v34.29,29.29 34.49,29.29 34.6,29.4
  Bottom 0.2: v22.4,60.5 38.81,60.5 v42,57.31 | v36.77,32.99 36.48,32.7 36.2,32.7 36.05,32.7 35.6,32.25 35.6,29.29 | v40.3,27.8 40,28.1 38.93,28.1 38.43,28.6 36.31,28.6 35.62,29.29 35.6,29.29 | 35.6,29.29 v34.29,29.29
SDA  (via drill 0.3)
  Top 0.2: U1.5 45.59,26.8 45,27.4 40.89,27.4 40.59,27.1 40.01,27.1 39.8,27.3 39.66,27.45 R1.1 37.4,28.5 v36.6,29.3 35.27,29.3 32.5,32.07 U3.19 | X1.11 41.8,58.5 42.7,57.6 42.7,37.93 36.77,32 v36.34,32
  Bottom 0.2: v36.34,32 36.6,31.74 v36.6,29.3
VCC  (via drill 0.3, 0.4, 0.6)
  Top 0.2: U3.14 v28.5,34.9 | U3.24 v35.1,35.9 | U3.2 v23.7,42.3 | U3.44 v26.9,46.3 | U3.7 26.8,38.3 v26.9,38.2
  Top 0.4: R1.2 R2.2 R3.2 | U1.8 49.41,23.25 C1.1 49.35,20.15 v49.3,20.1 | Q1.3 34.21,47.29 34.9,46.6 U3.34 v34.9,43.4 | v23.7,42.3 17.56,48.44 ISP1.2 | IC3.11 62.28,4.99 v62.3,5 | IC3.20 60.48,16.4 v58.4,16.4 v53.4,16.4 51.31,16.4 IC3.1
  Top 0.6: D2.C 20.15,30.25 24.85,25.55 R3.2
  Top 0.8: SJ1.2 35.44,3.56 33.8,5.2 32.95,5.2 C9.1 32.85,5.3 R8.2 32.8,7.45 32.8,8.4 33,8.6 U2.2 33,12.2 | 33,12.2 32.4,12.8 30.1,12.8 24.85,18.05 24.85,25.55 25.5,26.2 v25.5,33.6 | 33,12.2 33.5,12.7 39.2,12.7 42.9,16.4 v45.8,16.4
  Bottom 0.4: v35.1,35.9 34.1,34.9 v28.5,34.9 | v26.9,46.3 23.7,43.1 v23.7,42.3 24.8,42.3 25.5,43 28.7,43 29.7,42 | 29.7,42 29.7,39 28.9,38.2 v26.9,38.2 | v62.3,5 60.2,5 59.5,5.7 59.5,15.3 v58.4,16.4 | 29.7,42 33.5,42 v34.9,43.4 | v49.3,20.1 49.3,16.4
  Bottom 0.8: v25.5,33.6 26.8,34.9 v28.5,34.9 26.9,36.5 v26.9,38.2 | v45.8,16.4 49.3,16.4 v53.4,16.4

### Text on the board
tPlace: SCOTT RYAN | REV0.1 | EARTH CLOCK
bPlace: alleybeacheelctric@gmail.com